# EAGLE design Estufa PIC (EAGLE 9.5.1)

## Sheet 1 of 2
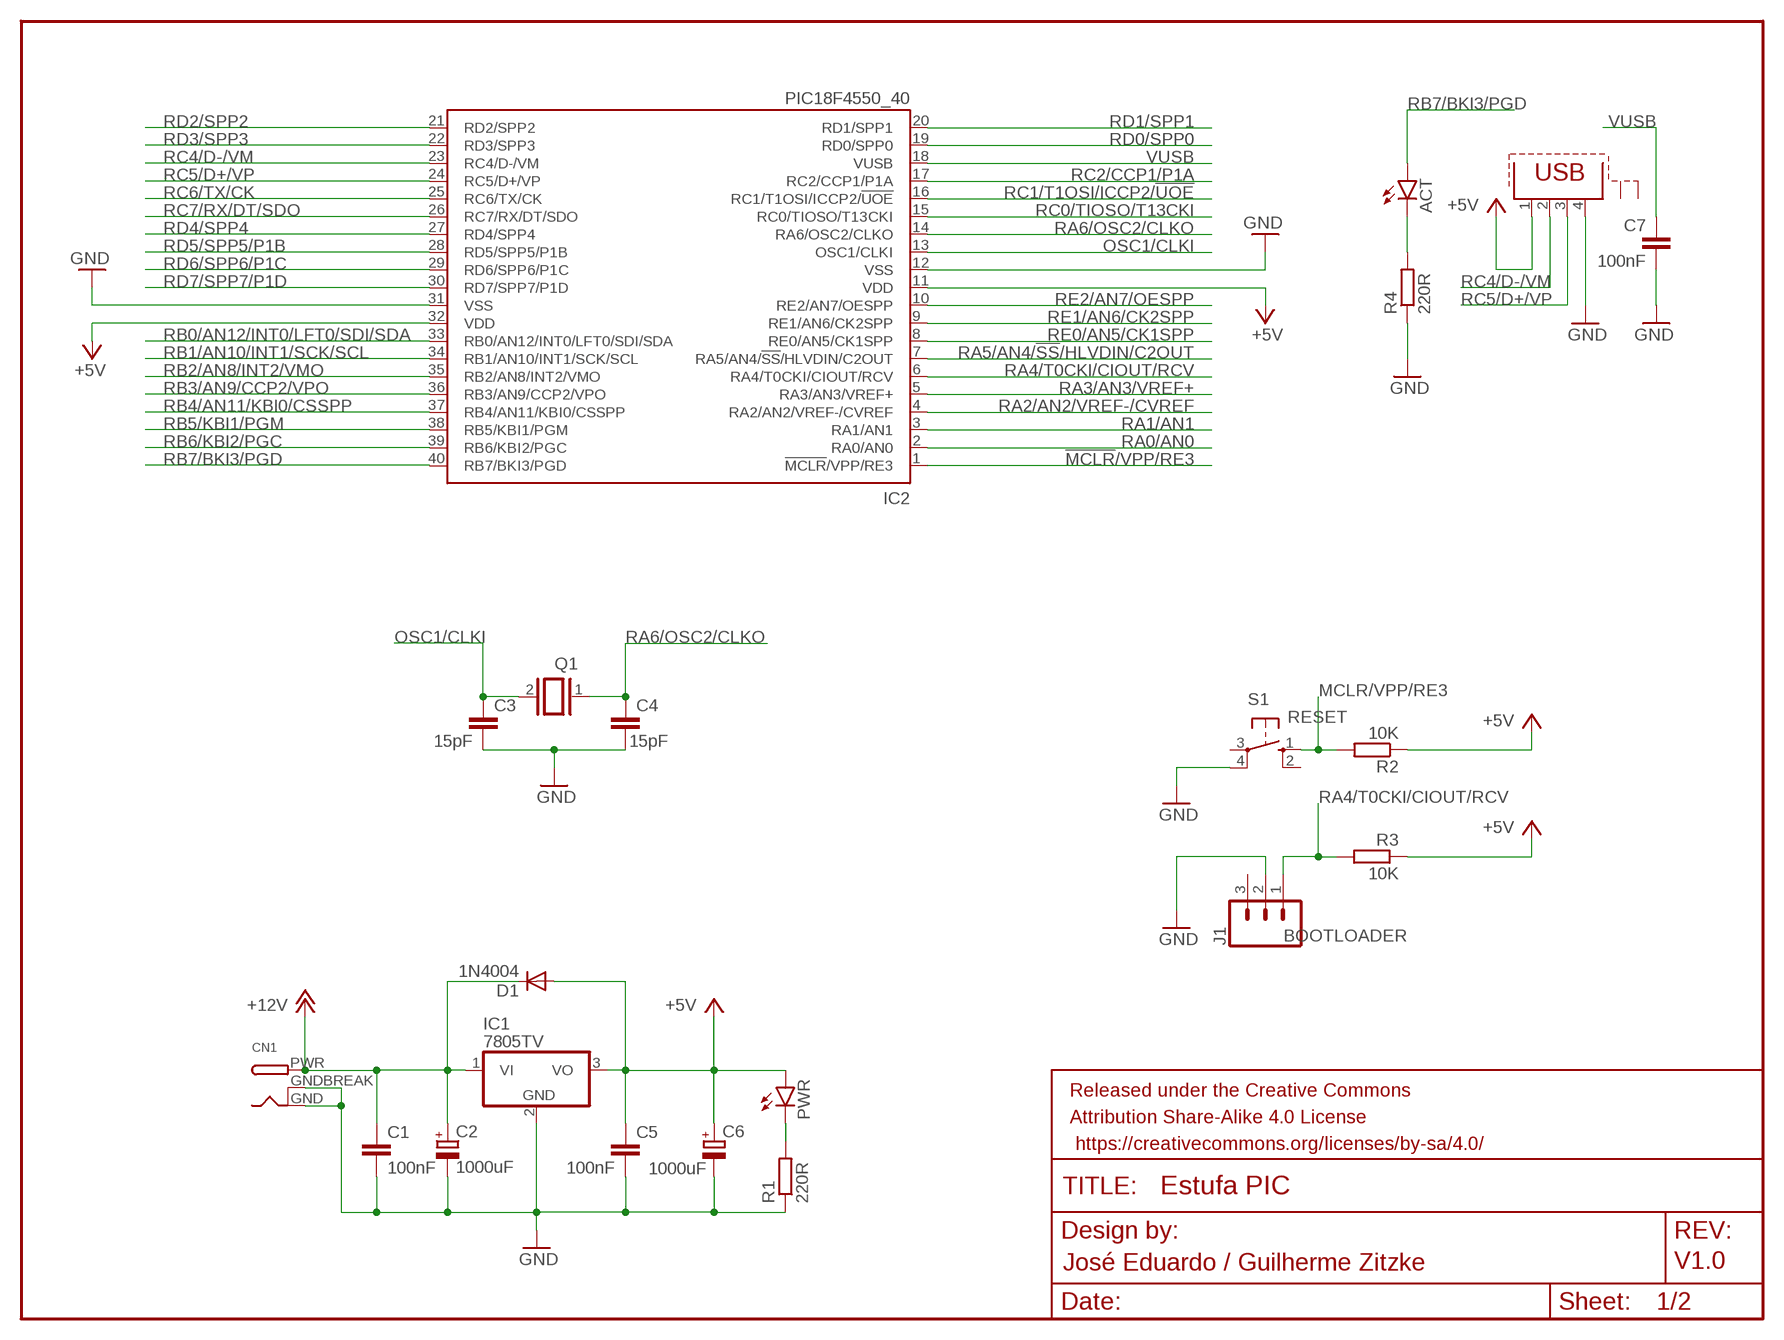
[diagram p0: schematic, sheet 1]

### Parts
ACT  LED5MM  [LED5MM]
C1  100nF  C-EU025-025X050  [C025-025X050]
C2  1000uF  CPOL-EUE5-10.5  [E5-10,5]
C3  15pF  C-EU025-025X050  [C025-025X050]
C4  15pF  C-EU025-025X050  [C025-025X050]
C5  100nF  C-EU025-025X050  [C025-025X050]
C6  1000uF  CPOL-EUE5-10.5  [E5-10,5]
C7  100nF  C-EU025-025X050  [C025-025X050]
CN1  DCBARRELPTH  [DCJACK_2MM_PTH]
D1  1N4004  [DO41-10]
FRAME1  FRAME-LETTERNO_PACKAGE  [DUMMY]
IC1  7805TV  [TO220V]
IC2  PIC18F4550_40  [DIL40]
J1  BOOTLOADER  CONN_03LOCK  [1X03_LOCK]
PWR  LED5MM  [LED5MM]
Q1  XTAL/S  [QS]
R1  220R  R-EU_0207/10  [0207/10]
R2  10K  R-EU_0207/10  [0207/10]
R3  10K  R-EU_0207/10  [0207/10]
R4  220R  R-EU_0207/10  [0207/10]
S1  RESET  40-XX  [B3F-40XX]
X1  PN61729-S  [PN61729-S]

### Nets
!MCLR!/VPP/RE3: IC2.1(!MCLR!/VPP/RE3)
+5V: C5.1 C6.+ D1.A IC1.3(VO) IC2.11(VDD) IC2.32(VDD) PWR.A R2.1 R3.1 X1.1 ; also sheet 2
+12V [potencia]: C1.1 C2.+ CN1.PWR D1.C IC1.1(VI) ; also sheet 2
GND: C1.2 C2.- C3.2 C4.2 C5.2 C6.- C7.2 CN1.GND CN1.GNDBREAK IC1.2(GND) IC2.12(VSS) IC2.31(VSS) J1.2 R1.1 R4.1 S1.4(P1) X1.4 ; also sheet 2
MCLR/VPP/RE3: R2.2 S1.1(S)
N$1: ACT.K(C) R4.2
N$2: PWR.K(C) R1.2
OSC1/CLKI: C3.1 IC2.13(OSC1/CLKI) Q1.2
RA0/AN0: IC2.2(RA0/AN0) ; also sheet 2
RA1/AN1: IC2.3(RA1/AN1)
RA2/AN2/VREF-/CVREF: IC2.4(RA2/AN2/VREF-/CVREF)
RA3/AN3/VREF+: IC2.5(RA3/AN3/VREF+)
RA4/T0CKI/CIOUT/RCV: IC2.6(RA4/T0CKI/CIOUT/RCV) J1.1 R3.2
RA5/AN4/!SS!/HLVDIN/C2OUT: IC2.7(RA5/AN4/!SS!/HLVDIN/C2OUT)
RA6/OSC2/CLKO: C4.1 IC2.14(RA6/OSC2/CLKO) Q1.1
RB0/AN12/INT0/LFT0/SDI/SDA: IC2.33(RB0/AN12/INT0/LFT0/SDI/SDA) ; also sheet 2
RB1/AN10/INT1/SCK/SCL: IC2.34(RB1/AN10/INT1/SCK/SCL) ; also sheet 2
RB2/AN8/INT2/VMO: IC2.35(RB2/AN8/INT2/VMO) ; also sheet 2
RB3/AN9/CCP2/VPO: IC2.36(RB3/AN9/CCP2/VPO) ; also sheet 2
RB4/AN11/KBI0/CSSPP: IC2.37(RB4/AN11/KBI0/CSSPP) ; also sheet 2
RB5/KBI1/PGM: IC2.38(RB5/KBI1/PGM) ; also sheet 2
RB6/KBI2/PGC: IC2.39(RB6/KBI2/PGC) ; also sheet 2
RB7/BKI3/PGD: ACT.A IC2.40(RB7/BKI3/PGD)
RC0/TIOSO/T13CKI: IC2.15(RC0/TIOSO/T13CKI)
RC1/T1OSI/ICCP2/!UOE: IC2.16(RC1/T1OSI/ICCP2/!UOE) ; also sheet 2
RC2/CCP1/P1A: IC2.17(RC2/CCP1/P1A) ; also sheet 2
RC4/D-/VM: IC2.23(RC4/D-/VM) X1.2
RC5/D+/VP: IC2.24(RC5/D+/VP) X1.3
RC6/TX/CK: IC2.25(RC6/TX/CK)
RC7/RX/DT/SDO: IC2.26(RC7/RX/DT/SDO)
RD0/SPP0: IC2.19(RD0/SPP0)
RD1/SPP1: IC2.20(RD1/SPP1)
RD2/SPP2: IC2.21(RD2/SPP2)
RD3/SPP3: IC2.22(RD3/SPP3)
RD4/SPP4: IC2.27(RD4/SPP4)
RD5/SPP5/P1B: IC2.28(RD5/SPP5/P1B)
RD6/SPP6/P1C: IC2.29(RD6/SPP6/P1C)
RD7/SPP7/P1D: IC2.30(RD7/SPP7/P1D)
RE0/AN5/CK1SPP: IC2.8(RE0/AN5/CK1SPP)
RE1/AN6/CK2SPP: IC2.9(RE1/AN6/CK2SPP)
RE2/AN7/OESPP: IC2.10(RE2/AN7/OESPP)
VUSB: C7.1 IC2.18(VUSB)
Unconnected: J1.3 S1.2(S1) S1.3(P) X1.S1 X1.S2

### Notes on the sheet
- José Eduardo / Guilherme Zitzke | V1.0

## Sheet 2 of 2
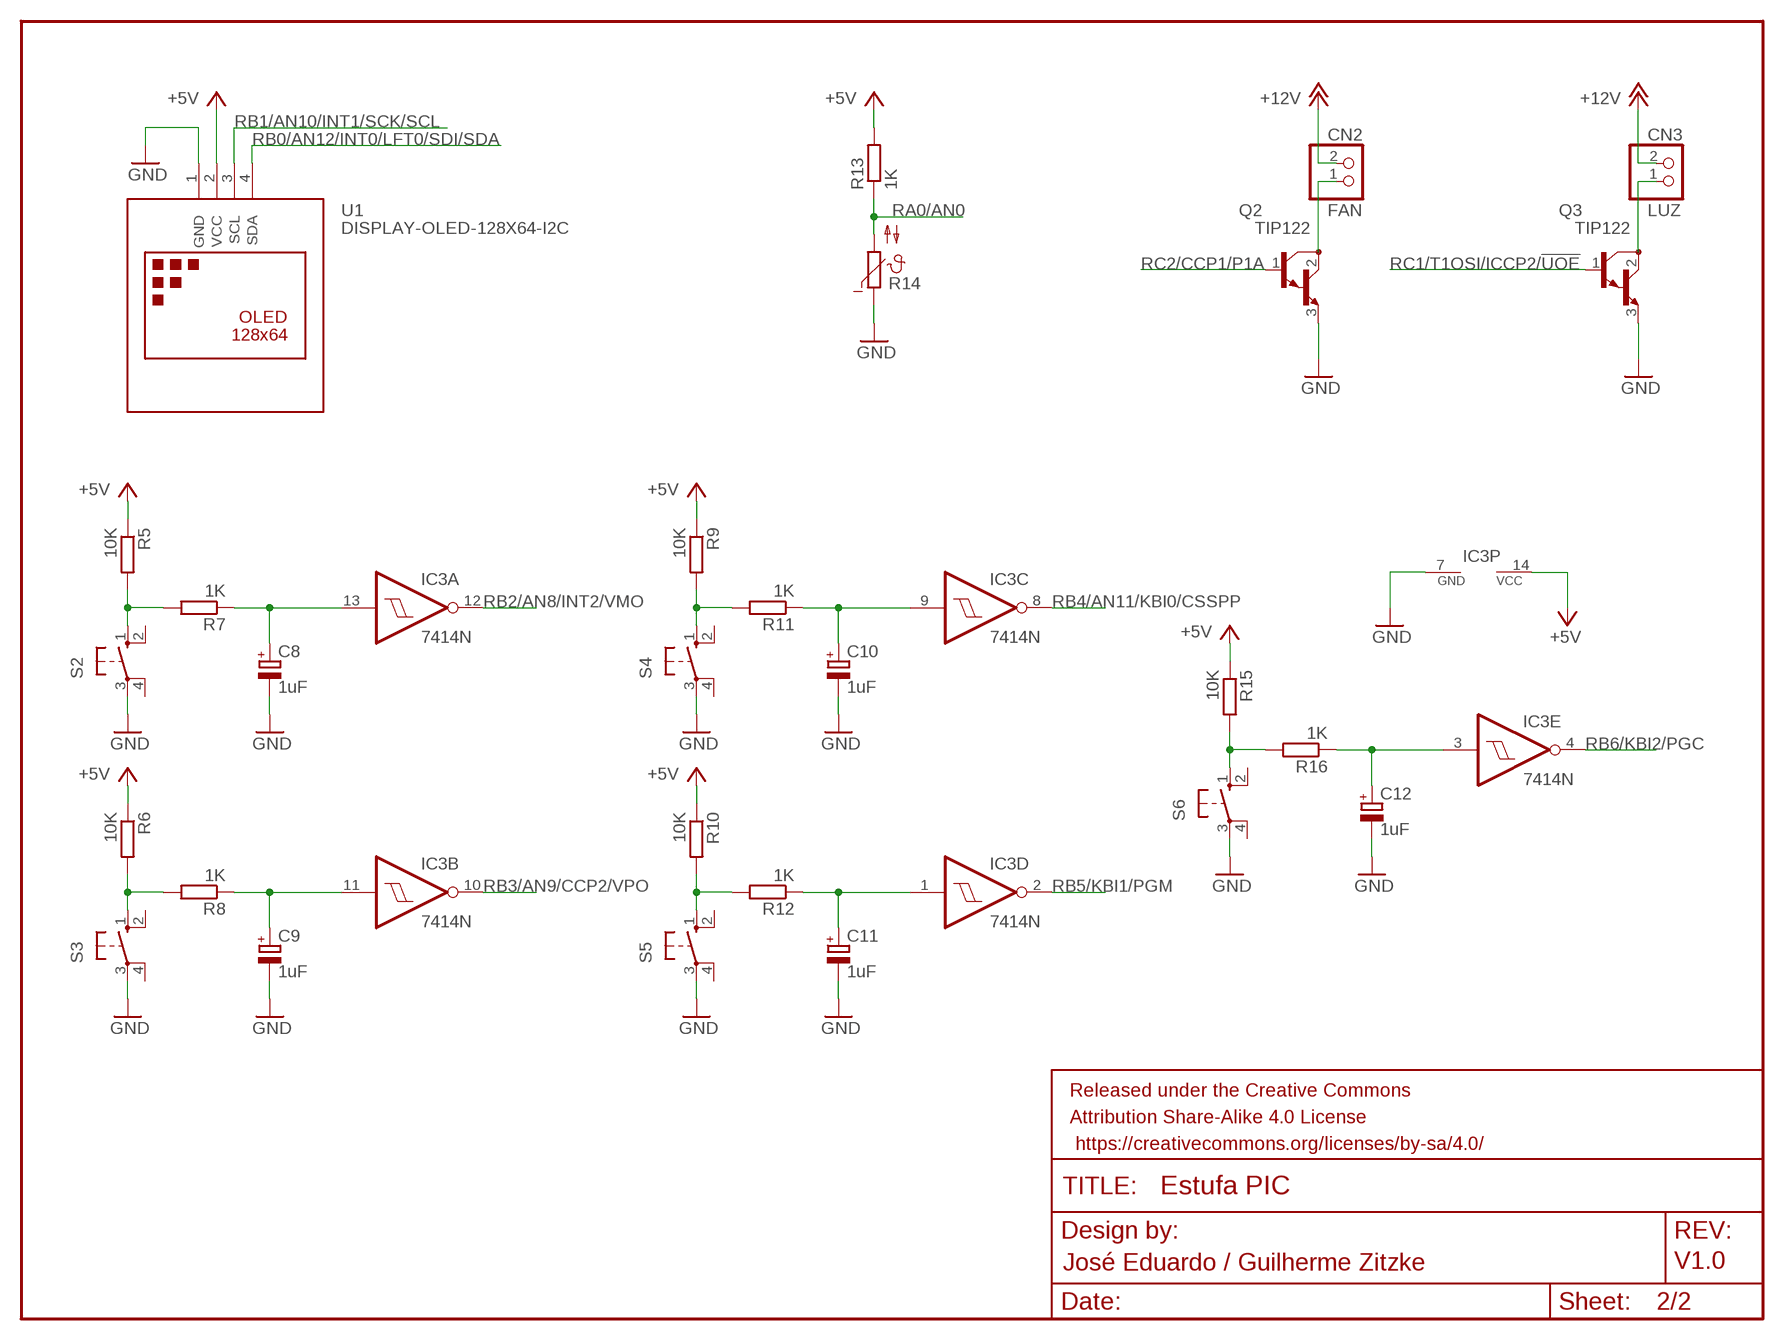
[diagram p1: schematic, sheet 2]

### Parts
C8  1uF  CPOL-EUE2-5  [E2-5]
C9  1uF  CPOL-EUE2-5  [E2-5]
C10  1uF  CPOL-EUE2-5  [E2-5]
C11  1uF  CPOL-EUE2-5  [E2-5]
C12  1uF  CPOL-EUE2-5  [E2-5]
CN2  FAN  JST_2PIN-THM  [JST-PH-2-THM]
CN3  LUZ  JST_2PIN-THM  [JST-PH-2-THM]
FRAME2  FRAME-LETTERNO_PACKAGE  [DUMMY]
IC3  7414N  [DIL14]
Q2  TIP122  [TO220V]
Q3  TIP122  [TO220V]
R5  10K  R-EU_0207/10  [0207/10]
R6  10K  R-EU_0207/10  [0207/10]
R7  1K  R-EU_0207/10  [0207/10]
R8  1K  R-EU_0207/10  [0207/10]
R9  10K  R-EU_0207/10  [0207/10]
R10  10K  R-EU_0207/10  [0207/10]
R11  1K  R-EU_0207/10  [0207/10]
R12  1K  R-EU_0207/10  [0207/10]
R13  1K  R-EU_0207/10  [0207/10]
R14  NTC644C  [N644C]
R15  10K  R-EU_0207/10  [0207/10]
R16  1K  R-EU_0207/10  [0207/10]
S2  40-XX  [B3F-40XX]
S3  40-XX  [B3F-40XX]
S4  40-XX  [B3F-40XX]
S5  40-XX  [B3F-40XX]
S6  40-XX  [B3F-40XX]
U1  DISPLAY-OLED-128X64-I2C  [DISPLAY-OLED-128X64-I2C]

### Nets
+5V: IC3.14(P:VCC) R5.1 R6.1 R9.1 R10.1 R13.2 R15.1 U1.2(VCC) ; also sheet 1
+12V [potencia]: CN2.2 CN3.2 ; also sheet 1
GND: C8.- C9.- C10.- C11.- C12.- IC3.7(P:GND) Q2.3(E) Q3.3(E) R14.1 S2.3(P) S3.3(P) S4.3(P) S5.3(P) S6.3(P) U1.1(GND) ; also sheet 1
N$3 [potencia]: CN3.1 Q3.2(C)
N$4: C8.+ IC3.13(A:I) R7.1
N$5 [potencia]: CN2.1 Q2.2(C)
N$6: R6.2 R8.2 S3.1(S)
N$7: C9.+ IC3.11(B:I) R8.1
N$8: R9.2 R11.2 S4.1(S)
N$9: C10.+ IC3.9(C:I) R11.1
N$10: R5.2 R7.2 S2.1(S)
N$11: R10.2 R12.2 S5.1(S)
N$12: C11.+ IC3.1(D:I) R12.1
N$13: R15.2 R16.2 S6.1(S)
N$14: C12.+ IC3.3(E:I) R16.1
RA0/AN0: R13.1 R14.2 ; also sheet 1
RB0/AN12/INT0/LFT0/SDI/SDA: U1.4(SDA) ; also sheet 1
RB1/AN10/INT1/SCK/SCL: U1.3(SCL) ; also sheet 1
RB2/AN8/INT2/VMO: IC3.12(A:O) ; also sheet 1
RB3/AN9/CCP2/VPO: IC3.10(B:O) ; also sheet 1
RB4/AN11/KBI0/CSSPP: IC3.8(C:O) ; also sheet 1
RB5/KBI1/PGM: IC3.2(D:O) ; also sheet 1
RB6/KBI2/PGC: IC3.4(E:O) ; also sheet 1
RC1/T1OSI/ICCP2/!UOE: Q3.1(B) ; also sheet 1
RC2/CCP1/P1A: Q2.1(B) ; also sheet 1
Unconnected: IC3.5(F:I) IC3.6(F:O) S2.2(S1) S2.4(P1) S3.2(S1) S3.4(P1) S4.2(S1) S4.4(P1) S5.2(S1) S5.4(P1) S6.2(S1) S6.4(P1)

### Notes on the sheet
- José Eduardo / Guilherme Zitzke | V1.0

## Library data of the parts
ACT PWR = led:LED: LED OSRAM: - CHIPLED LG R971, LG N971, LY N971, LG Q971, LY Q971, LO R971, LY R971 LH N974, LH R974 LS Q976, LO Q976, LY Q976 LO Q996 - Hyper CHIPLED LW Q18S LB Q993, LB Q99A, LB R99A - SideLED LS A670, LO A670, LY A670, LG A670, LP A670 LB A673, LV A673, LT A673, LW A673 LH A674 LY A675 LS A676, LA A676, LO A676, LY A676, LW A676 LS A679, LY A679, LG A679 - Hyper Micro SIDELED® LS Y876, LA Y876, LO Y876, LY Y876 LT Y87S - SmartLED LW L88C, LW L88S LB L89C, LB L89S, LG L890 LS L89K, LO L89K, LY L89K LS L896, LA L896, LO L896, LY L896 - TOPLED LS T670, LO T670, LY T670, LG T670, LP T670 LSG T670, LSP T670, LSY T670, LOP T670, LYG T670 LG T671, LOG T671, LSG T671 LB T673, LV T673, LT T673, LW T673 LH T674 LS T676, LA T676, LO T676, LY T676, LB T676, LH T676, LSB T676, LW T676 LB T67C, LV T67C, LT T67C, LS T67K, LO T67K, LY T67K, LW E67C LS E67B, LA E67B, LO E67B, LY E67B, LB E67C, LV E67C, LT E67C LW T67C LS T679, LY T679, LG T679 LS T770, LO T770, LY T770, LG T770, LP T770 LB T773, LV T773, LT T773, LW T773 LH T774 LS E675, LA E675, LY E675, LS T675 LS T776, LA T776, LO T776, LY T776, LB T776 LHGB T686 LT T68C, LB T68C - Hyper Mini TOPLED® LB M676 - Mini TOPLED Santana® LG M470 LS M47K, LO M47K, LY M47K Source: http://www.osram.convergy.de LUXEON: - LUMILED® LXK2-PW12-R00, LXK2-PW12-S00, LXK2-PW14-U00, LXK2-PW14-V00 LXK2-PM12-R00, LXK2-PM12-S00, LXK2-PM14-U00 LXK2-PE12-Q00, LXK2-PE12-R00, LXK2-PE12-S00, LXK2-PE14-T00, LXK2-PE14-U00 LXK2-PB12-K00, LXK2-PB12-L00, LXK2-PB12-M00, LXK2-PB14-N00, LXK2-PB14-P00, LXK2-PB14-Q00 LXK2-PR12-L00, LXK2-PR12-M00, LXK2-PR14-Q00, LXK2-PR14-R00 LXK2-PD12-Q00, LXK2-PD12-R00, LXK2-PD12-S00 LXK2-PH12-R00, LXK2-PH12-S00 LXK2-PL12-P00, LXK2-PL12-Q00, LXK2-PL12-R00 Source: www.luxeon.com KINGBRIGHT: KA-3528ASYC Source: www.kingbright.com
C1 C3-C5 C7 = rcl:C-EU: CAPACITOR, European symbol; SPICEPREFIX: C
C2 C6 C8-C12 = rcl:CPOL-EU: POLARIZED CAPACITOR, European symbol; SPICEPREFIX: C
CN1 = adafruit:DCBARREL: 2.0mm DC Barrel Jack DCJACK_2MM_PTH - Through Hole Jack (4UConnector: 05537)
CN2 CN3 = adafruit:JST_2PIN: JST 2-Pin Connectors of various flavors SMT-RA (S2B-PH-SM4) 4UConnector #17311 SMT (B2B-PH-SM4) THM-RA (S2B-PH) THM (B2B-PH)
D1 = adafruit:1N4004: DIODE General purpose 1N400x type rectifier (With bigger pads) http://www.ladyada.net/library/pcb/eaglelibrary.html
FRAME1 FRAME2 = SparkFun-Aesthetics:FRAME-LETTER: Schematic Frame - Letter Standard 8.5x11 US Letter frame; DESIGNER: Nobody; VERSION: v01
IC1 = linear:78*: Positive VOLTAGE REGULATOR Source: http://cache.national.com/ds/LM/LM78L05.pdf http://www.fairchildsemi.com/ds/LM/LM7805.pdf
IC2 = microchip:PIC18F4*_40: USB Microcontrollers with nanoWatt Technology High-Performance, Enhanced Flash, 28/40/44-Pin, Source: http://ww1.microchip.com/downloads/en/devicedoc/39632c.pdf; MF: MICROCHIP; MPN: PIC18F4550-I/P; OC_FARNELL: 9321357; OC_NEWARK: 74K8623
IC3 = 74xx-eu:74*14: Hex schmitt trigger INVERTER
J1 = SparkFun-Connectors:CONN_03: Multi connection point. Often used as Generic Header-pin footprint for 0.1 inch spaced/style header connections On any of the 0.1 inch spaced packages, you can populate with these: Break Away Headers - Straight <https://www.sparkfun.com/products/116> (PRT-00116) Break Away Male Headers - Right Angle <https://www.sparkfun.com/products/553> (PRT-00553) Female Headers <https://www.sparkfun.com/products/115> (PRT-00115) Break Away Headers - Machine Pin <https://www.sparkfun.com/products/117> (PRT-00117) Break Away Female Headers - Swiss Machine Pin <https://www.sparkfun.com/products/743> (PRT-00743) Stackable Header - 3 Pin (Female, 0.1") <https://www.sparkfun.com/products/13875> (PRT-13875) For SCREWTERMINALS and SPRING TERMINALS visit here: Screw Terimnals on SparkFun.com <https://www.sparkfun.com/search/results?term=Screw+Terminals> (5mm/3.5mm/2.54mm spacing) This device is also useful as a general connection point to wire up your design to another part of your project. Our various solder wires solder well into these plated through hole pads. Hook-Up Wire - Assortment (Stranded, 22 AWG) <https://www.sparkfun.com/products/11375> (PRT-11375) Hook-Up Wire - Assortment (Solid Core, 22 AWG) <https://www.sparkfun.com/products/11367> (PRT-11367) View the entire wire category on our website here <https://www.sparkfun.com/categories/141> Special notes: Molex polarized connector foot print use with SKU : PRT-08232 with associated crimp pins and housings.
Q1 = special:XTAL/S: CRYSTAL
Q2 Q3 = transistor-npn:TIP122*: NPN Darlington Transistor
R1-R13 R15 R16 = rcl:R-EU_: RESISTOR, European symbol; SPICEPREFIX: R
R14 = ptc-ntc:NTC644C: PHILIPS NTC; OC_FARNELL: unknown; OC_NEWARK: unknown
S1-S6 = adafruit:40-XX: OMRON SWITCH; MF: OMRON COMPONENTS USA; MPN: B3F-4000; OC_FARNELL: 176434; OC_NEWARK: 36K3105
U1 = diy-modules (2):DISPLAY-OLED-128X64-I2C: 128x64 Dot Matrix OLED Module based on SSD1306 chip Variant with I2C interface More details available here: http://www.instructables.com/id/Monochrome-096-i2c-OLED-display-with-arduino-SSD13/ SSD1306 datasheet: https://cdn-shop.adafruit.com/datasheets/SSD1306.pdf Click here to find device on ebay.com <http://www.ebay.com/sch/oled+display+128x64+iic> Note: There are two variants: I2C and SPI. Search for the proper version.
X1 = con-berg:PN61729-S: BERG USB connector; OC_FARNELL: unknown; OC_NEWARK: unknown

## Net classes
0 default: width 0.305 mm, drill 0.305 mm, clearance 0.305 mm
1 potencia: width 0.782 mm, drill 0.782 mm, clearance 0.782 mm to class 0, clearance 0.782 mm

## Board
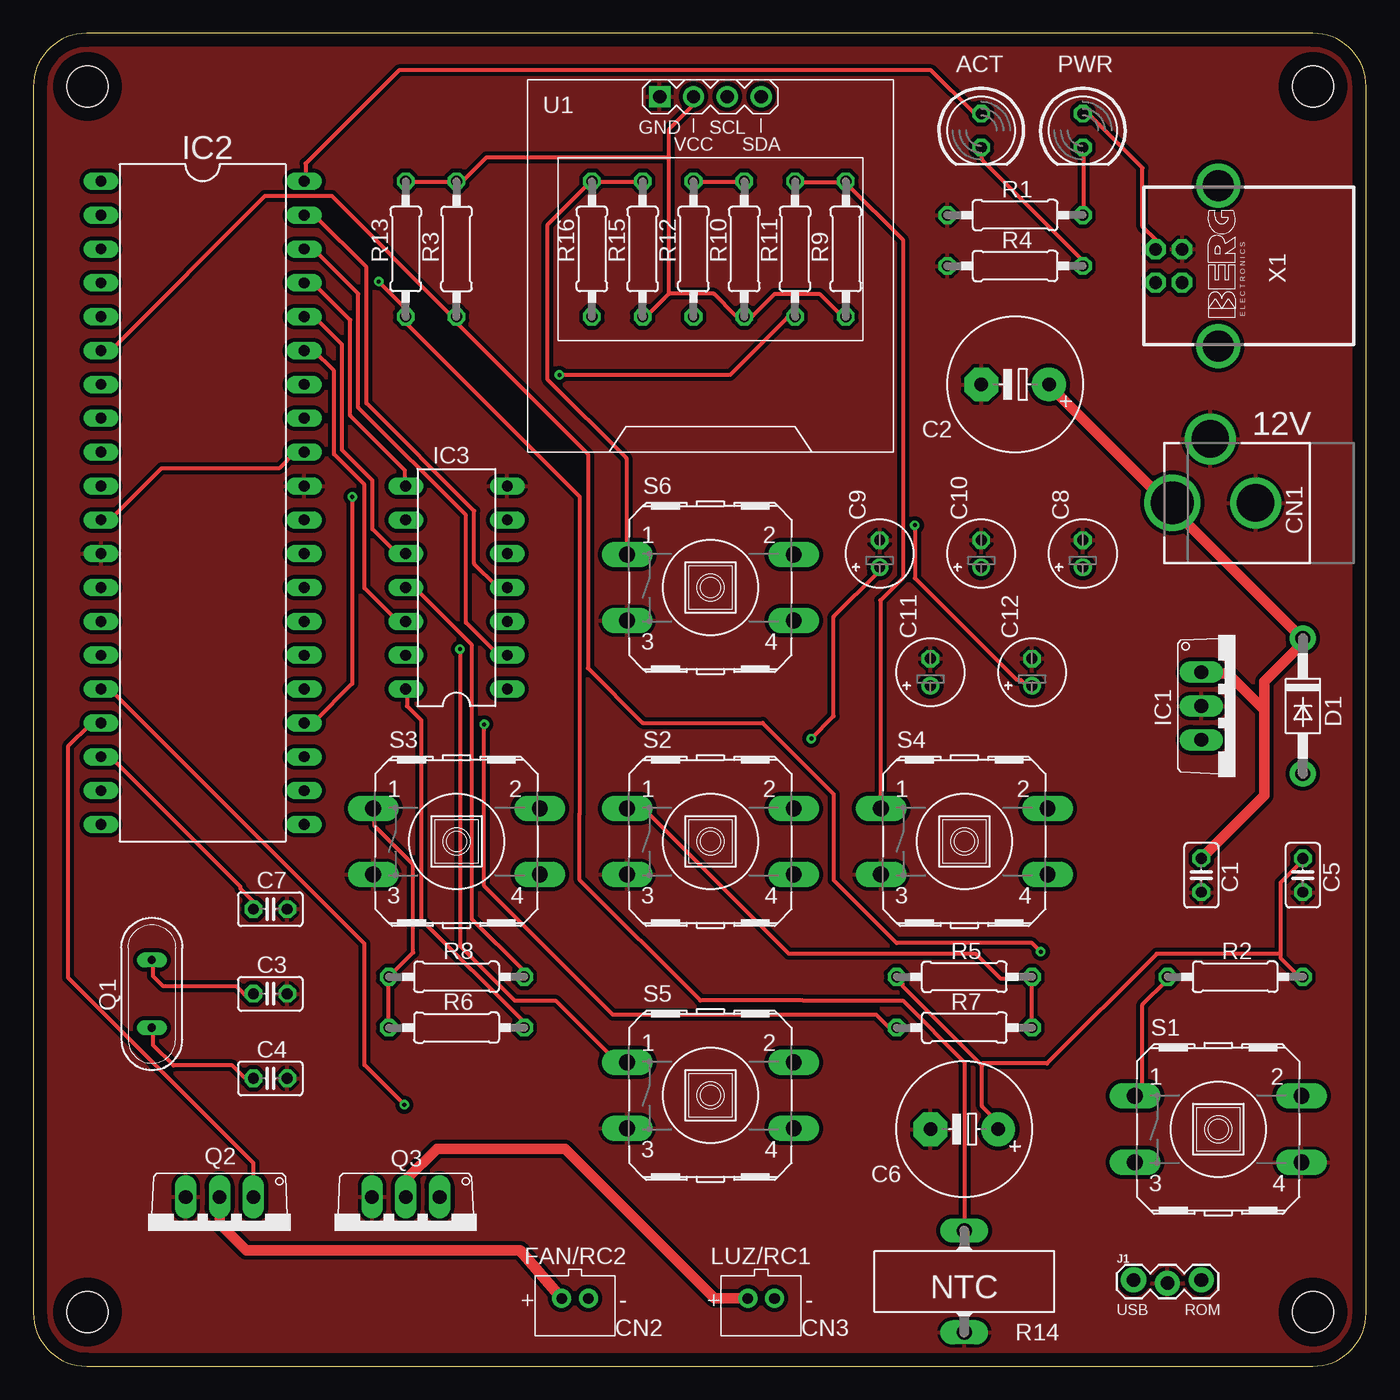
[diagram p2: board, top side]
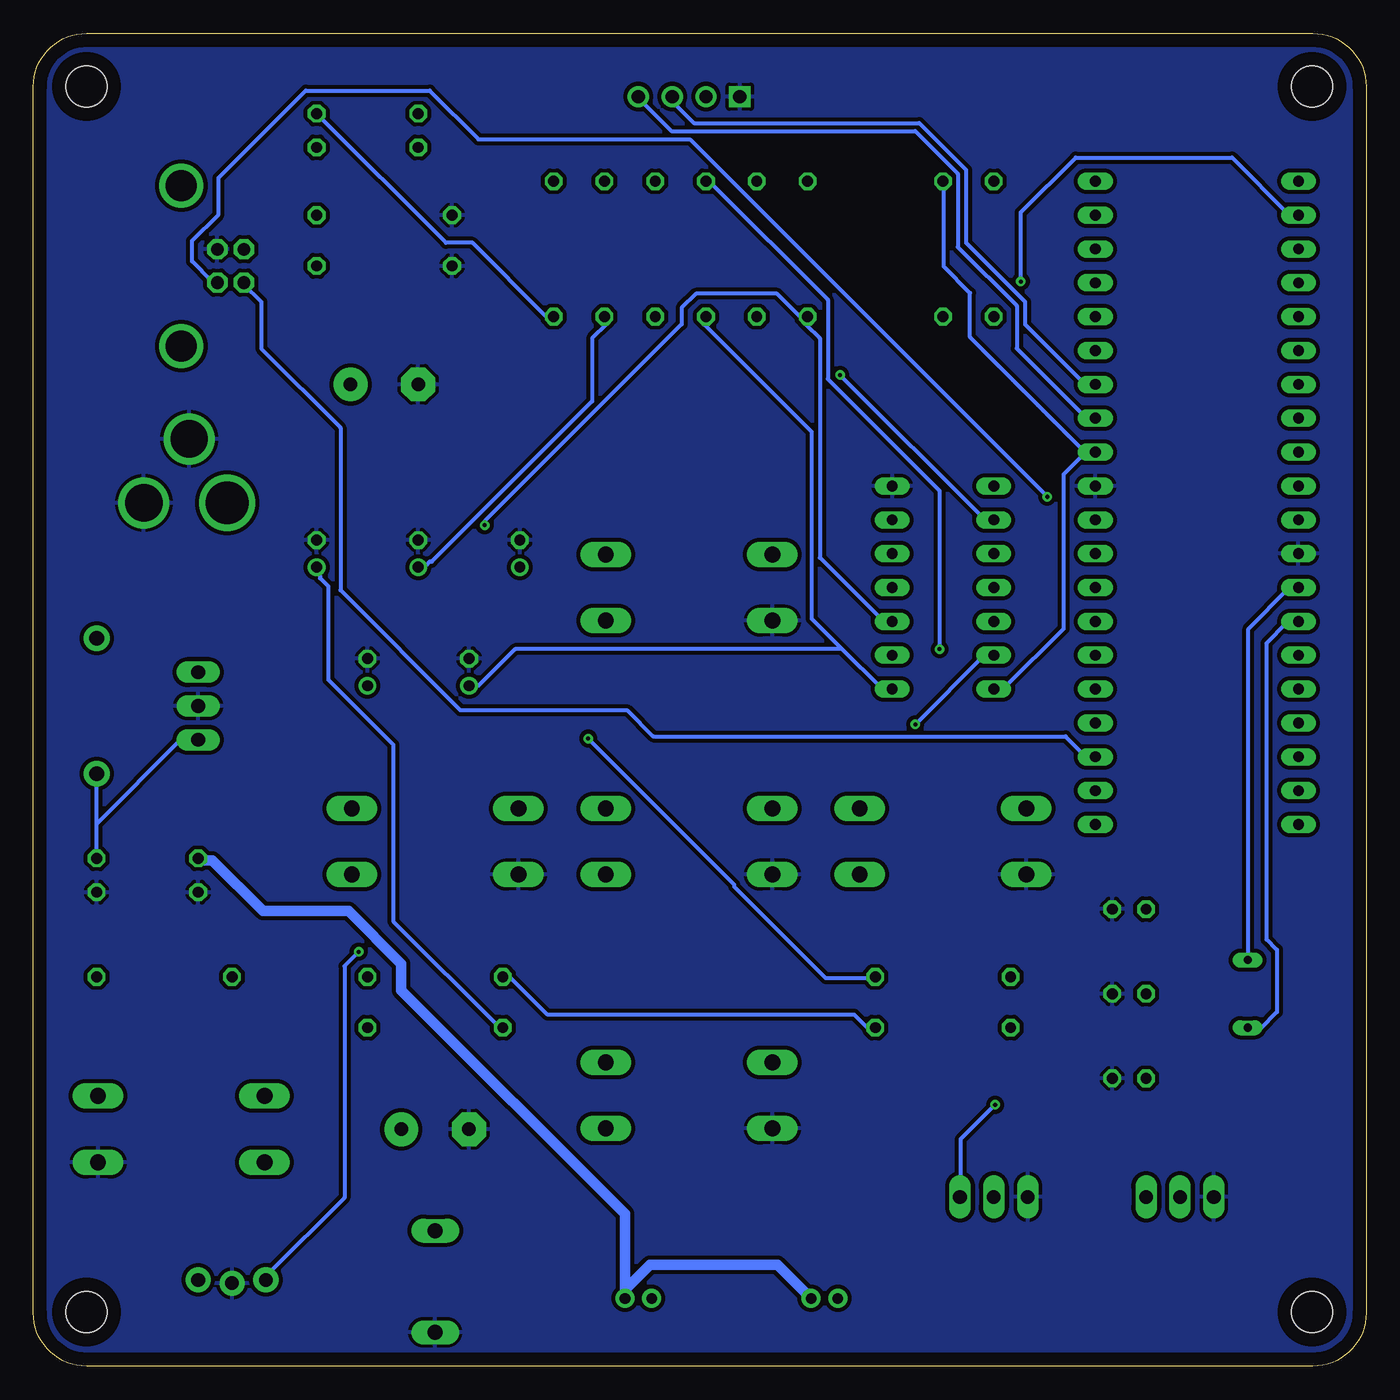
[diagram p3: board, bottom side, seen from below]

Size 100 x 100 mm. Coordinates in mm from the lower left corner, seen from the top.
Outline: 96,100 4,100 arc90 0,96 0,4 arc90 4,0 96,0 arc90 100,4 100,96 arc90 96,100
Copper layers (1*16): Top 0.035mm / dielectric 1.5mm / Bottom 0.035mm
Design rules "default *": minimum track width 12mil, minimum drill 12mil, track to track 12mil, track to pad 12mil, pad to pad 12mil, via to via 12mil, smd to smd 6mil, copper to edge 40mil, drill to drill 12mil, minimum pad ring 10mil, minimum via ring 8mil, stop-mask expansion 4mil, vias tented up to drill 0mil, thermal gap 10mil
Holes 3.1 mm at 4.06,4.06 96.01,4.06 4.06,96.01 96.01,96.01

### Footprints (pad centres in the part's own frame; a part is rotated, then mirrored left to right if it is on the bottom)
LED5MM = drill 0.813 octagon: A -1.27,0; K 1.27,0
C025-025X050 = drill 0.813 octagon: 1 -1.27,0; 2 1.27,0
E5-10,5 = drill 1.016 pad 2.54: + -2.54,0 | drill 1.016 pad 2.54 octagon: - 2.54,0
E2-5 = drill 0.813 pad 1.27: + -1.016,0 | drill 0.813 pad 1.27 octagon: - 1.016,0
DCJACK_2MM_PTH = drill 2.8: GND 0,7.35; GNDBREAK 4.8,10.75 | drill 3.2: PWR 0,13.6
JST-PH-2-THM = drill 0.8 pad 1.422: 1 1,0; 2 -1,0
DO41-10 = drill 1.118 pad 1.93: A 5.08,0; C -5.08,0
TO220V = drill 1.016 long: 1 -2.54,-2.54; 2 0,-2.54; 3 2.54,-2.54
DIL40 = drill 0.813 long: 1 -24.13,-7.62; 2 -21.59,-7.62; 3 -19.05,-7.62; 4 -16.51,-7.62; 5 -13.97,-7.62; 6 -11.43,-7.62; 7 -8.89,-7.62; 8 -6.35,-7.62; 9 -3.81,-7.62; 10 -1.27,-7.62; 11 1.27,-7.62; 12 3.81,-7.62; 13 6.35,-7.62; 14 8.89,-7.62; 15 11.43,-7.62; 16 13.97,-7.62; 17 16.51,-7.62; 18 19.05,-7.62; 19 21.59,-7.62; 20 24.13,-7.62; 21 24.13,7.62; 22 21.59,7.62; 23 19.05,7.62; 24 16.51,7.62; 25 13.97,7.62; 26 11.43,7.62; 27 8.89,7.62; 28 6.35,7.62; 29 3.81,7.62; 30 1.27,7.62; 31 -1.27,7.62; 32 -3.81,7.62; 33 -6.35,7.62; 34 -8.89,7.62; 35 -11.43,7.62; 36 -13.97,7.62; 37 -16.51,7.62; 38 -19.05,7.62; 39 -21.59,7.62; 40 -24.13,7.62
DIL14 = drill 0.813 long: 1 -7.62,-3.81; 2 -5.08,-3.81; 3 -2.54,-3.81; 4 0,-3.81; 5 2.54,-3.81; 6 5.08,-3.81; 7 7.62,-3.81; 8 7.62,3.81; 9 5.08,3.81; 10 2.54,3.81; 11 0,3.81; 12 -2.54,3.81; 13 -5.08,3.81; 14 -7.62,3.81
1X03_LOCK = drill 1.016 pad 1.88: 1 0,0.127; 2 2.54,-0.127; 3 5.08,0.127
QS = drill 0.61 long: 1 -2.54,0; 2 2.54,0
0207/10 = drill 0.813 octagon: 1 -5.08,0; 2 5.08,0
N644C = drill 1.118 long: 1 -3.81,0; 2 3.81,0
B3F-40XX = drill 1.194 long: 1 -6.248,2.489; 2 6.248,2.489; 3 -6.248,-2.489; 4 6.248,-2.489
DISPLAY-OLED-128X64-I2C = drill 1 square: 1 -3.81,12.7 | drill 1: 2 -1.27,12.7; 3 1.27,12.7; 4 3.81,12.7
PN61729-S = drill 0.95 octagon: 1 1.25,4.71; 2 -1.25,4.71; 3 -1.25,2.71; 4 1.25,2.71 | drill 2.3 pad 2.9: S1 -6.02,0; S2 6.02,0

### Placement (x,y rotation side)
ACT  71.12,92.71 270 top
C1  87.63,36.83 270 top
C2  73.66,73.66 180 top
C3  17.78,27.94 0 top
C4  17.78,21.59 0 top
C5  95.25,36.83 270 top
C6  69.85,17.78 180 top
C7  17.78,34.29 0 top
C8  78.74,60.96 90 top
C9  63.5,60.96 90 top
C10  71.12,60.96 90 top
C11  67.31,52.07 90 top
C12  74.93,52.07 90 top
CN1  99.06,64.77 90 top
CN2  40.64,5.08 180 top
CN3  54.61,5.08 180 top
D1  95.25,49.53 270 top
FRAME1  0,0 0 top
FRAME2  0,0 0 top
IC1  90.17,49.53 270 top
IC2  12.7,64.77 270 top
IC3  31.75,58.42 90 top
J1  82.55,6.35 0 top
PWR  78.74,92.71 270 top
Q1  8.89,27.94 90 top
Q2  13.97,10.16 180 top
Q3  27.94,10.16 180 top
R1  73.66,86.36 0 top
R2  90.17,29.21 180 top
R3  31.75,83.82 270 top
R4  73.66,82.55 0 top
R5  69.85,29.21 0 top
R6  31.75,25.4 180 top
R7  69.85,25.4 0 top
R8  31.75,29.21 180 top
R9  60.96,83.82 90 top
R10  53.34,83.82 90 top
R11  57.15,83.82 90 top
R12  49.53,83.82 90 top
R13  27.94,83.82 90 top
R14  69.85,6.35 90 top
R15  45.72,83.82 90 top
R16  41.91,83.82 90 top
S1  88.9,17.78 0 top
S2  50.8,39.37 0 top
S3  31.75,39.37 0 top
S4  69.85,39.37 0 top
S5  50.8,20.32 0 top
S6  50.8,58.42 0 top
U1  50.8,82.55 0 top
X1  88.9,82.55 90 top

### Tracks (layer width: path | path; a pad name or v marks a point on that pad's centre or on a via)
+5V
  Top 0.305: PWR.A 78.79,93.88 79.25,93.88 83.21,89.92 83.21,85.5 84.28,84.43 84.28,83.82 X1.1 | R13.2 27.99,88.85 31.7,88.85 R3.1 31.85,89 32.31,89 33.98,90.68 47.7,90.68 | 47.7,80.47 46.02,78.79 45.72,78.79 R15.1 | 47.7,80.47 51.05,80.47 52.73,78.79 53.34,78.79 | 53.34,78.79 53.95,78.79 55.63,80.47 58.98,80.47 60.66,78.79 60.96,78.79 R9.1 | 53.34,78.79 R10.1 | U1.2 49.53,94.64 47.7,92.81 47.7,90.68 | 47.7,80.47 47.7,90.68 | 71.09,22.63 71.17,22.55 71.17,19.51 72.39,18.29 C6.+ | 71.09,22.63 65.23,28.5 65.23,28.65 64.77,29.11 R5.1 | 93.57,30.94 93.57,36.27 95.25,37.95 C5.1 | 93.57,30.94 93.57,30.63 94.94,29.26 95.25,29.26 R2.1 | 93.57,30.94 84.28,30.94 76.05,22.71 71.17,22.71 71.09,22.63 | IC2.32 19.66,68.58 18.44,67.36 9.6,67.36 5.79,63.55 5.18,63.55 IC2.11 | R6.1 36.73,25.45 36.73,25.91 29.11,33.53 29.11,48.46 28.04,49.53 28.04,50.75 IC3.14
  Bottom 0.305: PWR.A 69.04,84.28 67.06,84.28 61.57,78.79 60.96,78.79 R9.1 | 95.25,40.69 89,46.94 87.63,46.94 IC1.3 | 21.06,68.56 21.03,68.58 IC2.32 | 21.06,68.56 22.71,66.9 22.71,55.32 27.13,50.9 27.89,50.9 IC3.14 | R5.1 64.77,29.11 64.16,29.11 61.42,26.36 38.41,26.36 37.34,25.3 36.88,25.3 R6.1 | 21.06,68.56 29.72,77.22 29.72,80.52 31.7,82.5 31.7,88.85 R3.1 | C5.1 95.25,40.69 | 95.25,40.69 D1.A
+12V
  Top 0.782: C2.+ 76.2,73.61 85.04,64.77 CN1.PWR 85.65,64.47 85.65,64.16 95.4,54.41 95.25,54.25 | C1.1 92.35,42.82 92.35,49.23 | 95.25,54.25 92.35,51.36 92.35,49.23 | D1.C 95.25,54.25 | 92.35,49.23 89.61,51.97 87.63,51.97 IC1.1
  Bottom 0.782: C1.1 87.33,38.1 87.17,37.95 86.56,37.95 82.75,34.14 76.35,34.14 72.39,30.18 72.39,28.19 55.61,11.41 CN3.2 55.49,5.2 55.49,5.86 53.73,7.62 44.18,7.62 CN2.2
GND
  pour Top (isolate 0.305): 0,0 0,100.33 100.33,100.33 100.33,0
  pour Bottom (isolate 0.305): -1.27,-1.27 -1.27,101.6 101.6,101.6 101.6,-1.27
MCLR/VPP/RE3
  Top 0.305: R2.2 85.04,29.11 85.04,28.96 83.21,27.13 83.21,20.73 82.75,20.27 S1.1
N$1
  Top 0.305: ACT.K 71.17,91.44 71.17,90.53 78.64,83.06 78.64,82.6 R4.2
N$2
  Top 0.305: R1.2 78.79,86.41 78.79,91.44 PWR.K
N$3
  Top 0.782: CN3.1 51.1,5.08 39.88,16.31 30.28,16.31 27.94,13.97 Q3.2
N$4  (via drill 0.3)
  Top 0.305: R7.1 64.77,25.45 64.16,25.45 63.25,26.36 52.07,26.36 51.21,26.36 43.48,26.36 33.83,36.02 v33.83,48.16
  Bottom 0.305: R7.1 64.77,25.45 65.08,25.45 73,33.38 73,46.63 77.88,51.51 77.88,58.52 78.49,59.13 78.49,59.28 78.64,59.44 78.64,59.89 C8.+ | IC3.13 28.65,53.34 v33.83,48.16
N$5
  Top 0.782: CN2.1 36.52,8.69 15.95,8.69 13.97,10.67 Q2.2
N$6
  Top 0.305: S3.1 25.6,41.76 25.6,40.54 28.5,37.64 28.5,31.04 R8.2 R6.2
N$7  (via drill 0.3)
  Top 0.305: IC3.11 28.04,58.37 28.65,58.37 32.92,54.1 32.92,33.53 36.73,29.72 36.73,29.26 R8.1 | v58.37,47.09 60.05,48.77 60.05,56.24 63.4,59.59 63.4,59.89 C9.+
  Bottom 0.305: v58.37,47.09 47.4,36.12 47.4,35.97 40.54,29.11 36.88,29.11 R8.1
N$8
  Top 0.305: 60.91,88.85 60.96,88.85 R9.2 | R11.2 57.15,88.85 60.91,88.85 | 60.91,88.85 65.23,84.53 65.23,59.13 63.55,57.45 63.55,41.91 S4.1
N$9  (via drill 0.3)
  Top 0.305: v39.47,74.37 52.27,74.37 56.54,78.64 57.15,78.64 R11.1
  Bottom 0.305: C10.+ 71.02,60.05 70.56,60.05 70.26,60.35 70.1,60.35 58.06,72.39 58.06,77.11 57,78.18 57,78.49 57.15,78.64 R11.1 | v39.47,74.37 28.65,63.55 28.04,63.55 IC3.9
N$10
  Top 0.305: S2.1 44.65,41.76 45.87,41.76 56.69,30.94 70.71,30.94 72.54,29.11 74.83,29.11 R5.2 R7.2
N$11  (via drill 0.3)
  Top 0.305: R12.2 49.53,88.85 53.34,88.85 R10.2 | v32,53.8 32,31.55 36.12,27.43 39.17,27.43 43.74,22.86 44.5,22.86 S5.1
  Bottom 0.305: v32,53.8 32,65.68 40.39,74.07 40.39,80.01 49.23,88.85 49.53,88.85 R12.2
N$12
  Bottom 0.305: 39.32,53.8 36.42,50.9 35.66,50.9 IC3.1 | R12.1 49.53,78.64 49.68,78.49 49.68,78.18 41.6,70.1 41.6,56.08 39.32,53.8 | C11.+ 66.6,51.05 63.86,53.8 39.32,53.8
N$13
  Top 0.305: R15.2 45.72,88.85 41.91,88.85 R16.2 41.86,88.9 38.56,85.6 38.56,74.07 44.5,68.12 44.5,60.96 S6.1
N$14  (via drill 0.3)
  Top 0.305: C12.+ 74.52,51.05 74.07,51.51 73.76,51.51 66.14,59.13 v66.14,63.09
  Bottom 0.305: 42.06,78.33 42.06,78.49 41.91,78.64 R16.1 42.06,78.33 | 42.06,78.33 42.06,78.18 41,77.11 41,60.66 36.27,55.93 35.66,55.93 IC3.3 | v66.14,63.09 66.14,63.4 51.36,78.18 51.36,79.4 50.29,80.47 44.2,80.47 42.06,78.33
OSC1/CLKI
  Top 0.305: Q1.2 8.99,30.48 8.99,29.26 9.75,28.5 15.24,28.5 15.85,27.89 16.46,27.89 C3.1
  Bottom 0.305: IC2.13 5.18,58.37 5.79,58.37 8.84,55.32 8.84,30.48 Q1.2
RA0/AN0  (via drill 0.3)
  Top 0.305: v25.91,81.38 28.04,79.25 28.04,78.79 R13.1 28.04,78.64 28.04,78.18 41,65.23 41,41.91 41,41.45 41,36.47 50.04,27.43 57.76,27.43 58.42,27.43 65.23,27.43 69.85,22.81 R14.2
  Bottom 0.305: v25.91,81.38 25.91,86.56 21.79,90.68 10.06,90.68 5.79,86.41 5.18,86.41 IC2.2
RA4/T0CKI/CIOUT/RCV  (via drill 0.3)
  Top 0.305: IC2.6 5.79,76.2 17.37,87.78 22.4,87.78 31.39,78.79 31.7,78.79 R3.2 31.85,78.64 31.85,78.18 41.6,68.43 41.6,52.38 45.72,48.26 54.71,48.26 60.05,42.93 60.05,36.47 64.77,31.75 74.93,31.75 v75.59,31.09
  Bottom 0.305: v75.59,31.09 76.66,30.02 76.66,12.65 82.45,6.86 82.45,6.55 J1.1
RA6/OSC2/CLKO
  Top 0.305: Q1.1 8.99,25.3 8.99,24.08 10.52,22.55 14.94,22.55 15.85,21.64 16.46,21.64 C4.1
  Bottom 0.305: Q1.1 7.87,25.4 6.71,26.57 6.71,31.24 7.47,32 7.47,54.25 5.94,55.78 5.18,55.78 IC2.14
RB0/AN12/INT0/LFT0/SDI/SDA
  Bottom 0.305: IC2.33 20.42,71.17 21.03,71.17 26.21,76.35 26.21,79.55 30.63,83.97 30.63,89.46 33.83,92.66 52.12,92.66 54.71,95.25 U1.4
RB1/AN10/INT1/SCK/SCL
  Bottom 0.305: IC2.34 20.42,73.76 21.18,73.76 25.6,78.18 25.6,79.86 30.02,84.28 30.02,89.76 33.53,93.27 50.44,93.27 51.97,94.79 51.97,95.25 U1.3
RB2/AN8/INT2/VMO
  Top 0.305: IC2.35 21.03,76.2 22.55,74.68 22.55,68.43 24.84,66.14 24.84,58.37 27.28,55.93 27.89,55.93 IC3.12
RB3/AN9/CCP2/VPO
  Top 0.305: IC3.10 27.28,60.96 25.45,62.79 25.45,66.45 23.16,68.73 23.16,76.66 21.18,78.64 20.42,78.64 IC2.36
RB4/AN11/KBI0/CSSPP
  Top 0.305: IC2.37 20.42,81.23 21.03,81.23 23.77,78.49 23.77,71.32 27.89,67.21 27.89,66.14 IC3.8
RB5/KBI1/PGM
  Top 0.305: IC2.38 21.03,83.82 24.38,80.47 24.38,71.93 32.46,63.86 32.46,55.78 34.9,53.34 IC3.2
RB6/KBI2/PGC
  Top 0.305: IC2.39 20.42,86.26 21.18,86.26 24.99,82.45 24.99,72.24 33.07,64.16 33.07,60.2 34.75,58.52 35.51,58.52 IC3.4
RB7/BKI3/PGD
  Top 0.305: IC2.40 20.42,89 20.42,90.22 27.43,97.23 67.36,97.23 70.56,94.03 71.02,94.03 ACT.A
RC1/T1OSI/ICCP2/!UOE  (via drill 0.3)
  Top 0.305: v27.84,19.61 24.84,22.61 24.84,31.7 5.79,50.75 5.18,50.75 IC2.16
  Bottom 0.305: v27.84,19.61 30.43,17.02 30.43,12.75 Q3.1
RC2/CCP1/P1A
  Top 0.305: IC2.17 5.03,48.16 4.27,48.16 2.59,46.48 2.59,29.16 16.51,15.24 Q2.1
RC4/D-/VM
  Bottom 0.305: IC2.23 21.03,45.72 22.55,47.24 53.49,47.24 55.47,49.23 67.97,49.23 76.96,58.22 76.96,70.41 82.91,76.35 82.91,79.86 84.28,81.23 X1.2
RC5/D+/VP  (via drill 0.3)
  Top 0.305: v23.93,65.23 23.93,51.21 21.03,48.31 20.42,48.31 IC2.24
  Bottom 0.305: v23.93,65.23 50.75,92.05 66.6,92.05 70.26,95.71 79.55,95.71 86.11,89.15 86.11,86.41 88.09,84.43 88.09,82.91 86.56,81.38 86.26,81.38 X1.3
VUSB
  Top 0.305: IC2.18 5.79,45.72 15.54,35.97 15.54,35.81 16.46,34.9 16.46,34.29 C7.1

### Text on the board
tNames: 12V | FAN/RC2 | LUZ/RC1 | NTC | USB | ROM